# Altium project JIG_TEST_AUX_PIXYO-V10A.PrjPcb
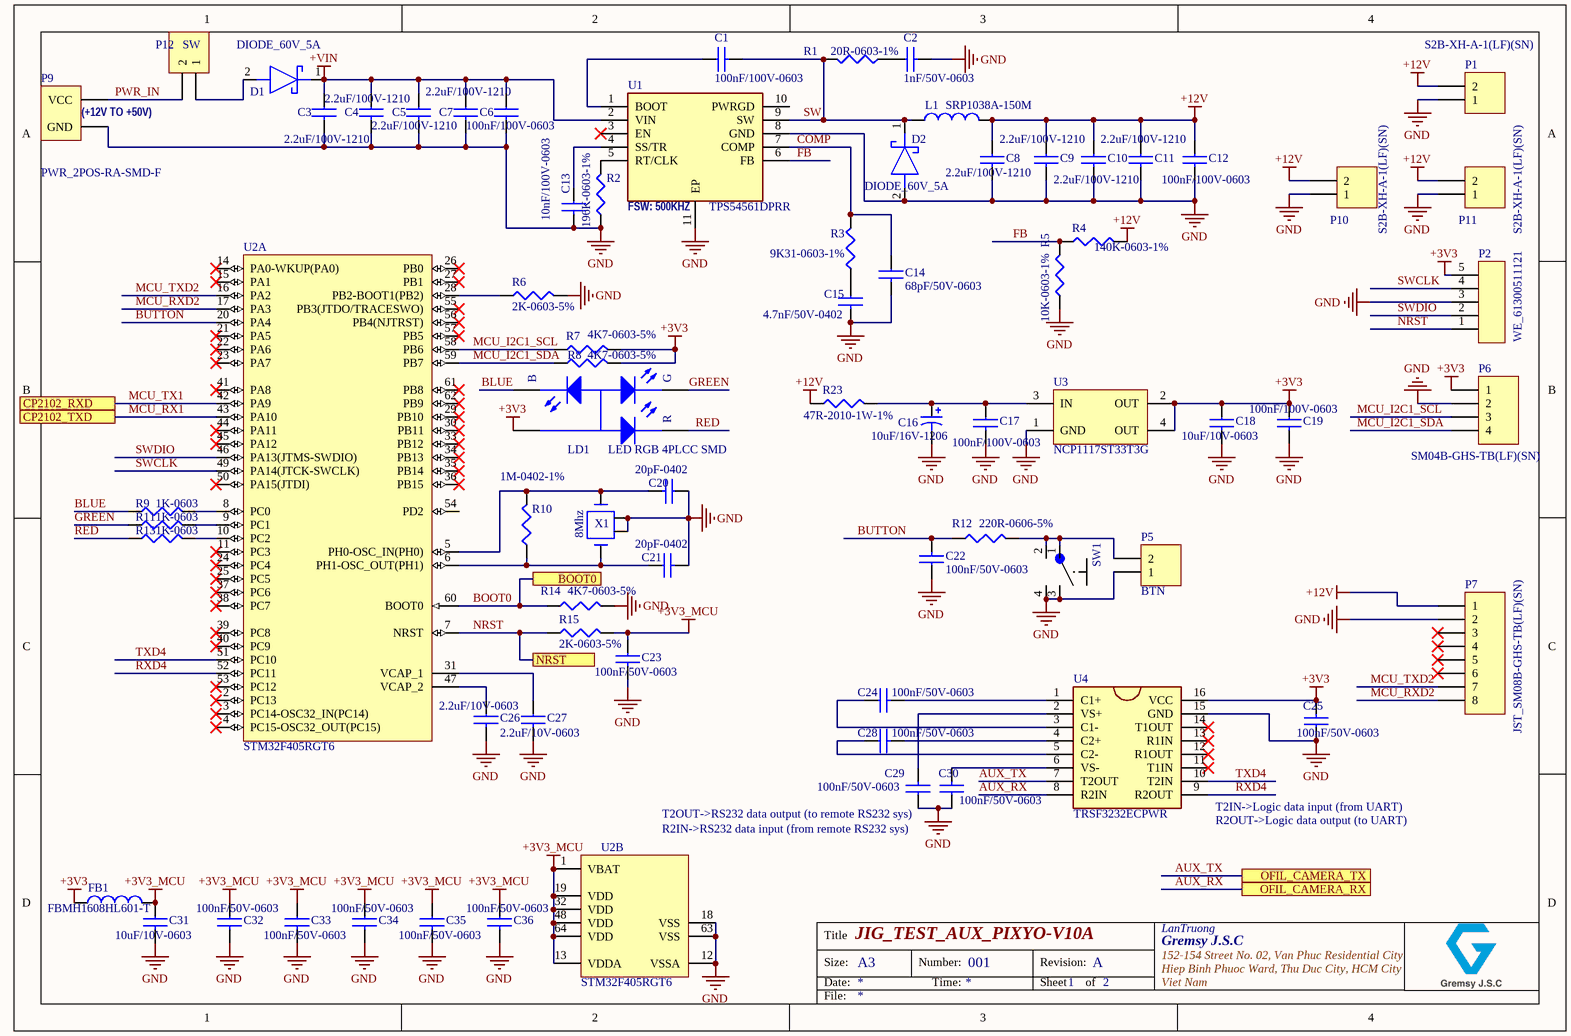
[diagram p0: JIG_TEST_AUX_PIXYO-V10A.SchDoc]
2 sheets, 95 parts. Net scope: flat (ports and power ports of the same name join across sheets).
Board files: JIG_TEST_AUX_PIXYO-V10A.PcbDoc, 3D fan.PcbDoc
Sheets:
  JIG_TEST_AUX_PIXYO-V10A.SchDoc
  CP2102_UART.SchDoc

## Sheet JIG_TEST_AUX_PIXYO-V10A.SchDoc: JIG_TEST_AUX_PIXYO-V10A
size A4; Author: LanTruong; CompanyName: Gremsy J.S.C; Organization: Altium Limited; Address1: 152-154 Street No. 02, Van Phuc Residential City; Address2: Hiep Binh Phuoc Ward, Thu Duc City, HCM City; Address3: Viet Nam; DocumentNumber: 001; Revision: A; SheetNumber: 1; SheetTotal: 2

### Parts
C1  100nF/100V-0603  [CAP0603]
C2  1nF/50V-0603  [CAP0603]
C3  2.2uF/100V-1210  [CAP1210]
C4  2.2uF/100V-1210  [CAP1210]
C5  2.2uF/100V-1210  [CAP1210]
C6  100nF/100V-0603  [CAP0603]
C7  2.2uF/100V-1210  [CAP1210]
C8  2.2uF/100V-1210  [CAP1210]
C9  2.2uF/100V-1210  [CAP1210]
C10  2.2uF/100V-1210  [CAP1210]
C11  2.2uF/100V-1210  [CAP1210]
C12  100nF/100V-0603  [CAP0603]
C13  10nF/100V-0603  [CAP0603]
C14  68pF/50V-0603  [CAP0603]
C15  4.7nF/50V-0402  [CAP0402]
C16  10uF/16V-1206  [CAP1206_TANTALUM_YELLOW]
C17  100nF/100V-0603  [CAP0603]
C18  10uF/10V-0603  [CAP0603]
C19  100nF/100V-0603  [CAP0603]
C20  20pF-0402  [CAP0402]
C21  20pF-0402  [CAP0402]
C22  100nF/50V-0603  [CAP0603]
C23  100nF/50V-0603  [CAP0603]
C24  100nF/50V-0603  [CAP0603]
C25  100nF/50V-0603  [CAP0603]
C26  2.2uF/10V-0603  [CAP0603]
C27  2.2uF/10V-0603  [CAP0603]
C28  100nF/50V-0603  [CAP0603]
C29  100nF/50V-0603  [CAP0603]
C30  100nF/50V-0603  [CAP0603]
C31  10uF/10V-0603  [CAP0603]
C32  100nF/50V-0603  [CAP0603]
C33  100nF/50V-0603  [CAP0603]
C34  100nF/50V-0603  [CAP0603]
C35  100nF/50V-0603  [CAP0603]
C36  100nF/50V-0603  [CAP0603]
D1  DIODE_60V_5A  [SODFL4725X105N]
D2  DIODE_60V_5A  [SODFL4725X105N]
FB1  FBMH1608HL601-T  [INDC0603]
L1  SRP1038A-150M  [INDC_SRP1038A-150M]
LD1  LED RGB 4PLCC SMD  [LED RGB 4PLCC SMD]
P1  S2B-XH-A-1(LF)(SN)  [XH2.54 2P 2pin XH-2AW Right Angle]
P2  WE_61300511121  [HDR_1x5_2m54]
P5  BTN  [JST_SM02B-GHS-TB(LF)(SN)]
P6  SM04B-GHS-TB(LF)(SN)  [JST_SM04B-GHS-TB(LF)(SN)]
P7  JST_SM08B-GHS-TB(LF)(SN)  [JST_SM08B-GHS-TB(LF)(SN)]
P9  PWR_2POS-RA-SMD-F  [DC-050]
P10  S2B-XH-A-1(LF)(SN)  [XH2.54 2P 2pin XH-2AW Right Angle]
P11  S2B-XH-A-1(LF)(SN)  [XH2.54 2P 2pin XH-2AW Right Angle]
P12  SW  [JST_B2B-XH-A(LF)(SN)]
R1  20R-0603-1%  [RES0603]
R2  196K-0603-1%  [RES0603]
R3  9K31-0603-1%  [RES0603]
R4  140K-0603-1%  [RES0603]
R5  10K-0603-1%  [RES0603]
R6  2K-0603-5%  [RES0603]
R7  4K7-0603-5%  [RES0603]
R8  4K7-0603-5%  [RES0603]
R9  1K-0603  [RES0603]
R10  1M-0402-1%  [RES0402]
R11  1K-0603  [RES0603]
R12  220R-0606-5%  [RES0603]
R13  1K-0603  [RES0603]
R14  4K7-0603-5%  [RES0603]
R15  2K-0603-5%  [RES0603]
R23  47R-2010-1W-1%  [RES2010]
SW1  SW_FSM14JLH  [Pushbutton 6x6mm]  (value not drawn)
U1  TPS54561DPRR  [SON80P400X400X80-11N-D]
U2  STM32F405RGT6  [LQFP64_L]  (parts A,B of 2)
U3  NCP1117ST33T3G  [SOT223-4M]
U4  TRSF3232ECPWR  [TSSOP-16]
X1  8Mhz  [XTAL_SMD5032]

### Ports
BOOT0, CP2102_RXD, CP2102_TXD, NRST, OFIL_CAMERA_RX, OFIL_CAMERA_TX

### Nets
+3V3: C18.1 C19.1 C25.2 FB1.1 LD1.2(A) P2.5 P6.1 R7.2 R8.2 U3.2(OUT) U3.4(OUT) U4.16(VCC)
+3V3_MCU: C23.1 C31.1 C32.1 C33.1 C34.1 C35.1 C36.1 FB1.2 R15.2 U2.1(VBAT) U2.13(VDDA) U2.19(VDD) U2.32(VDD) U2.48(VDD) U2.64(VDD)
+12V: C8.1 C9.1 C10.1 C11.1 C12.1 L1.2 P1.2 P7.1 P10.2 P11.2 R4.2 R23.1
+VIN: C3.1 C4.1 C5.1 C6.1 C7.1 D1.1(K) U1.2(VIN)
GND: C2.2 C3.2 C4.2 C5.2 C6.2 C7.2 C8.2 C9.2 C10.2 C11.2 C12.2 C13.2 C14.2 C15.2 C16.2 C17.2 C18.2 C19.2 C20.1 C21.2 C22.1 C23.2 C25.1 C26.2 C27.2 C29.1 C30.1 C31.2 C32.2 C33.2 C34.2 C35.2 C36.2 D2.2(A) P1.1 P2.3 P5.1 P6.2 P7.2 P9.2(GND) P10.1 P11.1 R2.1 R5.1 R6.2 R14.2 SW1.3 SW1.4 U1.8(GND) U1.11(EP) U2.12(VSSA) U2.18(VSS) U2.63(VSS) U3.1(GND) U4.15(GND) X1.2(GND) X1.4(GND)
AUX_RX: U4.8(R2IN) ; port OFIL_CAMERA_RX
AUX_TX: U4.7(T2OUT) ; port OFIL_CAMERA_TX
BLUE: LD1.3(B) R9.1
BOOT0: R14.1 U2.60(BOOT0) ; port BOOT0
BUTTON: C22.2 R12.1 U2.20(PA4)
COMP: C14.1 R3.2 U1.7(COMP)
FB: R4.1 R5.2 U1.6(FB)
GREEN: LD1.4(G) R11.1
MCU_I2C1_SCL: P6.3 R7.1 U2.58(PB6)
MCU_I2C1_SDA: P6.4 R8.1 U2.59(PB7)
MCU_RX1: U2.43(PA10) ; port CP2102_TXD  [project net CP2102_TXD]
MCU_RXD2: P7.8 U2.17(PA3)
MCU_TX1: U2.42(PA9) ; port CP2102_RXD  [project net CP2102_RXD]
MCU_TXD2: P7.7 U2.16(PA2)
NRST: P2.1 R15.1 U2.7(NRST) ; port NRST
PWR_IN: P9.1(VCC) P12.2
RED: LD1.1(R) R13.1
RXD4: U2.52(PC11) U4.9(R2OUT)
SW: C1.2 D2.1(K) L1.1 R1.2 U1.9(SW)
SWCLK: P2.4 U2.49(PA14(JTCK-SWCLK))
SWDIO: P2.2 U2.46(PA13(JTMS-SWDIO))
TXD4: U2.51(PC10) U4.10(T2IN)
NetC1_1: C1.1 U1.1(BOOT)
NetC2_1: C2.1 R1.1
NetC13_1: C13.1 U1.4(SS/TR)
NetC15_1: C15.1 R3.1
NetC16_1: C16.1 C17.1 R23.2 U3.3(IN)
NetC20_2: C20.2 R10.2 U2.5(PH0-OSC_IN(PH0)) X1.3(OSC2)
NetC21_1: C21.1 R10.1 U2.6(PH1-OSC_OUT(PH1)) X1.1(OSC1)
NetC24_1: C24.1 U4.3(C1-)
NetC24_2: C24.2 U4.1(C1+)
NetC26_1: C26.1 U2.47(VCAP_2)
NetC27_1: C27.1 U2.31(VCAP_1)
NetC28_1: C28.1 U4.5(C2-)
NetC28_2: C28.2 U4.4(C2+)
NetC29_2: C29.2 U4.2(VS+)
NetC30_2: C30.2 U4.6(VS-)
NetD1_2: D1.2(A) P12.1
NetP5_2: P5.2 R12.2 SW1.1 SW1.2
NetR2_2: R2.2 U1.5(RT/CLK)
NetR6_1: R6.1 U2.28(PB2-BOOT1(PB2))
NetR9_2: R9.2 U2.8(PC0)
NetR11_2: R11.2 U2.9(PC1)
NetR13_2: R13.2 U2.10(PC2)

Not connected (* = marked no-connect by the designer): P7 3* 4* 5* 6*; U1 3(EN)* 10(PWRGD); U2 2(PC13)* 3(PC14-OSC32_IN(PC14))* 4(PC15-OSC32_OUT(PC15))* 11(PC3)* 14(PA0-WKUP(PA0))* 15(PA1)* 21(PA5)* 22(PA6)* 23(PA7)* 24(PC4)* 25(PC5)* 26(PB0)* 27(PB1)* 29(PB10)* 30(PB11)* 33(PB12)* 34(PB13)* 35(PB14)* 36(PB15)* 37(PC6)* 38(PC7)* 39(PC8)* 40(PC9)* 41(PA8)* 44(PA11)* 45(PA12)* 50(PA15(JTDI))* 53(PC12)* 54(PD2) 55(PB3(JTDO/TRACESWO))* 56(PB4(NJTRST))* 57(PB5)* 61(PB8)* 62(PB9)*; U4 11(T1IN)* 12(R1OUT)* 13(R1IN)* 14(T1OUT)*

### Notes on the sheet
- (near P9) (+12V TO +50V)
- (near U1) FSW: 500KHZ
- T2OUT->RS232 data output (to remote RS232 sys)
- R2IN->RS232 data input (from remote RS232 sys)
- (near U4) T2IN->Logic data input (from UART)
- (near U4) R2OUT->Logic data output (to UART)
- Title
- Size:
- Date:
- A3
- Number:
- Time:
- Revision:
- Sheet
- of
- File:

### Library data of the parts
C1 C6 C12 C17 C19 = CAP_100nF/100V-0603-10%: CAP CER 0.1UF 100V X7R 0603; Manufacturer: Yageo; MfrP/N: CC0603KRX7R0BB104; Tolerance: ±10%; Value: 100nF; GremsyP/N: 102-100n-007-0; Supplier 1: Digi-Key; Package / Case: 0603 (1608 Metric); ComponentLink1URL: http://media.digikey.com/pdf/Data%20Sheets/Yageo%20PDFs/NPO,%20X7R%20Mid-voltage.pdf; ComponentLink1Description: http://media.digikey.com/pdf/Data%20Sheets/Yageo%20PDFs/NPO,%20X7R%20Mid-voltage.pdf; Supplier Part Number 1: 311-1523-1-ND; Voltage - Rated: 100V
C2 = CAP_1nF/50V-0603-10%: CAP CER 1000PF 50V X7R 0603; Manufacturer: Yageo; MfrP/N: CC0603KRX7R9BB102; Tolerance: 10%; GremsyP/N: 102-1n-0030; Supplier 1: Digi-Key; Case/Package: 0603; Supplier Part Number 1: 311-1080-1-ND; Voltage: 50V
C3-C5 C7-C11 = CAP_2.2uF/100V-1210-10%: CAP CER 2.2UF 100V X7R 1210; Manufacturer: Taiyo Yuden; MfrP/N: HMK325B7225KN-T; Tolerance: ±10%; GremsyP/N: 102-2u2-0070; Supplier 1: Digi-Key; ComponentLink1URL: http://www.yuden.co.jp/productdata/catalog/en/mlcc06_e.pdf; ComponentLink1Description: http://www.yuden.co.jp/productdata/catalog/en/mlcc06_e.pdf; Supplier Part Number 1: 587-1778-1-ND; Value: 2.2uF; Voltage - Rated: 100V
C13 = CAP_10nF/100V-0603-10%: CAP CER 10000PF 100V X7R 0603; Manufacturer: Yageo; MfrP/N: CC0603KRX7R0BB103; GremsyP/N: 102-10n-0040; Tolerance: ±10%; Supplier 1: Mouser; Case/Package: 0603; Supplier Part Number 1: 603-CC603KRX7R0BB103
C14 = CAP_68pF/50V-0603-5%: CAP CER 68PF 50V C0G/NPO 0603; Manufacturer: Yageo; MfrP/N: CC0603JRNPO9BN680; Tolerance: ±5%; GremsyP/N: 102-68p-002-0; Supplier 1: Digi-Key; Voltage - Rated: 50V; Package / Case: 0603 (1608 Metric); ComponentLink1URL: http://www.yageo.com/documents/recent/UPY-GP_NP0_16V-to-50V_16.pdf; ComponentLink1Description: http://www.yageo.com/documents/recent/UPY-GP_NP0_16V-to-50V_16.pdf; Supplier Part Number 1: 311-1067-1-ND; Value: 68pF
C15 = CAP_4.7nF/50V-0402-5%: CAP CER 4700PF 50V X7R 0402; Manufacturer 1: KEMET; MfrP/N: C0402C472J5RACAUTO; Tolerance: 5%; Capacitance: 4.7nF; GremsyP/N: 102-4n7-001-0; Supplier 1: Digi-Key; Supplier Part Number 1: 399-C0402C472J5RACAUTOCT-ND; Case/Package: 0402; Voltage Rating (DC): 50V
C16 = CAP_10uF/16V-1206-10%: CAP TANT 10UF 16V 10% 1206; Manufacturer 1: KEMET; MfrP/N: T491A106K016AT; GremsyP/N: 102-10u-0070; Supplier 1: Digi-Key; Supplier Part Number 1: 399-8269-1-ND; Package / Case: 1206 (3216 Metric); ComponentLink1URL: http://www.kemet.com/Lists/ProductCatalog/Attachments/254/KEM_T2005_T491.pdf; ComponentLink1Description: http://www.kemet.com/Lists/ProductCatalog/Attachments/254/KEM_T2005_T491.pdf; Value: 10uF; Tolerance: ±10%; Voltage - Rated: 16V
C18 C31 = CAP_10uF/10V-0603-10%: CAP CER 10UF 10V X5R 0603; Manufacturer 1: Yageo; MfrP/N: CC0603KRX5R6BB106; Tolerance: ±10%; GremsyP/N: 102-10u-0050; Supplier 1: Digi-Key; Supplier Part Number 1: 311-1782-1-ND; Voltage - Rated: 10V; Package / Case: 0603 (1608 Metric); ComponentLink1URL: http://www.yageo.com/documents/recent/UPY-GPHC_X5R_4V-to-50V_24.pdf; ComponentLink1Description: http://www.yageo.com/documents/recent/UPY-GPHC_X5R_4V-to-50V_24.pdf; Value: 10uF
C20 C21 = CAP_20pF/50V-0402-1%: CAP CER 20PF 50V C0G/NP0 0402; Manufacturer 1: Murata; MfrP/N: GJM1555C1H200FB01D; Tolerance: 1%; GremsyP/N: 102-20p-001-0; Supplier 1: Digi-Key; Supplier Part Number 1: 490-11204-1-ND; Case/Package: 0402; Capacitance: 20pF; Voltage Rating: 50V
C22-C25 C28-C30 C32-C36 = CAP_100nF/50V-0603-10%: CAP CER 0.1UF 50V X7R 0603; Manufacturer 1: Yageo; MfrP/N: CC0603KRX7R9BB104; Tolerance: ±10%; Value: 100nF; GremsyP/N: 102-100n-005-0; Supplier 1: Digi-Key; Supplier Part Number 1: 311-1344-1-ND; Voltage - Rated: 50V; Package / Case: 0603 (1608 Metric); ComponentLink1URL: http://www.yageo.com/documents/recent/UPY-GPHC_X7R_6.3V-to-50V_18.pdf; ComponentLink1Description: http://www.yageo.com/documents/recent/UPY-GPHC_X7R_6.3V-to-50V_18.pdf
C26 C27 = CAP_2.2uF/10V-0603-10%: CAP CER 2.2UF 10V X7R 0603; Manufacturer 1: Yageo; MfrP/N: CC0603KRX7R6BB225; Category 1: Capacitors; Capacitance: 2.2µF; Tolerance: ±10%; GremsyP/N: 102-2u2-0010; Supplier 1: Digi-Key; Supplier Part Number 1: 311-1797-1-ND; Description 1: CAP CER 2.2UF 10V X7R 0603; Stock 1: 14291; Pricing 1: 1=0.32, 10=0.219, 100=0.1238, 500=0.0874, 1000=0.07648 (USD); Voltage - Rated: 10V; Temperature Coefficient: X7R; Operating Temperature: -55°C ~ 125°C; Package / Case: 0603 (1608 Metric); ComponentLink1URL: http://www.yageo.com/documents/recent/UPY-GPHC_X7R_6.3V-to-50V_18.pdf; ComponentLink1Description: http://www.yageo.com/documents/recent/UPY-GPHC_X7R_6.3V-to-50V_18.pdf; Value: 2.2uF
D1 D2 = DIODE-SCHOTTKY_RB088LAM-60TFTR: Schottky Diode; Manufacturer_Name: ROHM Semiconductor; GremsyP/N: 104-SCKY-011-0; Datasheet Link: https://www.mouser.com/datasheet/2/348/rb088lam-60tftr-e-1507871.pdf; Height: 1.05mm; MfrP/N: RB088LAM-60TFTR; Mouser Part Number: 755-RB088LAM-60TFTR; Mouser Price/Stock: https://www.mouser.com/Search/Refine.aspx?Keyword=755-RB088LAM-60TFTR; ComponentLink1Description: DIODE; ComponentLink1URL: https://www.mouser.vn/ProductDetail/ROHM-Semiconductor/RB088LAM-60TFTR?qs=sGAEpiMZZMutXGli8Ay4kPB6XEQFysSpXpnTjPttNqQ%3D; Manufacturer Part Number: RB088LAM-60TFTR
FB1 = FB-0603_FBMH1608HL601-T: FERRITE BEAD 600 OHM 0603 1LN; Manufacturer: Taiyo Yuden; Filter Type: Power Line; Number of Lines: 1; Impedance @ Frequency: 600 Ohm @ 100MHz; Current Rating (Max): 500mA; DC Resistance (DCR) (Max): 450 mOhm; GremsyP/N: 10E-FB0603-002-0; Supplier 1: Digi-Key; MfrP/N: FBMH1608HL601-T; RoHS: RoHS Compliant; Category: Filters; Stock 1: 9499; Pricing 1: 1=0.11, 10=0.094, 25=0.0732, 50=0.0606, 100=0.0523, 250=0.0418, 500=0.03762, 1000=0.03135 (USD); Packaging: Cut Tape (CT); Part Status: Active; Ratings: -; Operating Temperature: -40°C ~ 125°C; Package / Case: 0603 (1608 Metric); Mounting Type: Surface Mount; Height (Max): 0.035" (0.90mm); Size / Dimension: 0.063" L x 0.031" W (1.60mm x 0.80mm); ComponentLink1URL: http://ds.yuden.co.jp/TYCOMPAS/ut/detail.do?productNo=FBMH1608HL601-T&fileName=FBMH1608HL601-T_SS&mode=specSheetDownload; ComponentLink1Description: http://ds.yuden.co.jp/TYCOMPAS/ut/detail.do?productNo=FBMH1608HL601-T&fileName=FBMH1608HL601-T_SS&mode=specSheetDownload; Supplier Part Number 1: 587-1737-1-ND
L1 = IND_SRP1038A-150M: BOURNS   SRP1038A-150M   INDUCTOR, SHIELDED, 15UH, 20%, 6.25A; Core Material: Carbonyl Powder; Saturation Current: 10A; DC Resistance (DCR): 45mR; Self Resonant Frequency: 9MHz; Test Frequency: 100kHz; Supplier 1: Digi-Key; Manufacturer: Bourns; Manufacturer Part Number: SRP1038A-150M; Stock 1: 6638; Pricing 1: 1=1.51, 10=1.397, 100=0.9781 (USD); Mount: Surface Mount; Case/Package: Nonstandard; Min Operating Temperature: -40°C; Max Operating Temperature: 125°C; Inductance Tolerance: 20%; Packaging: Cut Tape; Tolerance: 20%; Composition: Wirewound; Inductance: 15uh; Current Rating: 6.25A; Shielding: Shielded; Max DC Current: 6.25A; Termination: SMD/SMT; RMS Current (Irms): 6.25A; Length: 0.433inch; Height: 3.8mm; Width: 0.394inch; Height - Seated (Max): 0.157inch; Depth: 10mm; REACH SVHC: No SVHC; ComponentLink1URL: https://datasheet.ciiva.com/46395/1828822-46395253.pdf; ComponentLink1Description: https://datasheet.ciiva.com/46395/1828822-46395253.pdf; ComponentLink2URL: https://datasheet.ciiva.com/48685/srp1038a-48685046.pdf; ComponentLink2Description: https://datasheet.ciiva.com/48685/srp1038a-48685046.pdf; Supplier Part Number 1: SRP1038A-150MDKR-ND
LD1 = LED-RGB_4PLCC_SMD: MfrP/N: VLMRGB343-ST-UV-RS; Supplier 1: Digi-Key; Supplier Part Number 1: 516-3280-1-ND; GremsyP/N: *
P1 P10 P11 = CON-JST_S2B-XH-A-1(LF)(SN): WTB-XH_2POS-P2.54-RA-TH; Manufacturer 1: JST; Description 1: 2 Position Through-Hole Shrouded Header; Category 1: Connectors; GremsyP/N: 106-JST-001; ComponentLink1Description: XH2.54 2P; ComponentLink1URL: https://www.thegioiic.com/products/cong-xh2-54-2-chan-cong; Supplier 1: Digi-Key; Supplier Part Number 1: 455-4226-ND; MfrP/N: S2B-XH-A-1(LF)(SN); RoHS 1: No; Stock 1: 2579; Pricing 1: 1=0.18000, 10=0.15200, 100=0.11650, 500=0.09862, 1000=0.08068, 5000=0.07172, 10000=0.06500 (USD); Lead Free: Lead Free
P2 = CON-WE_61300511121_DUPLICATE: HEADER HDR 1X5-P2.54-ST-TH-MALE; GremsyP/N: 106-WE-002; ComponentLink1Description: CONN HEADER VERT 5POS 2.54MM; ComponentLink1URL: https://www.digikey.com/product-detail/en/w-rth-elektronik/61300511121/732-5318-ND/4846831; MfrP/N: 61300511121
P5 = CON-JST_SM02B-GHS-TB(LF)(SN): WTB-GH_2POS-P1.25-RA-SMD; Manufacturer: JST Sales America Inc.; Connector Type: Header; Pitch - Mating: 0.049" (1.25mm); Number of Positions: 2; Number of Positions Loaded: All; Style: Board to Cable/Wire; Shrouding: Shrouded - 4 Wall; Material Flammability Rating: UL94 V-0; Current Rating: 1A; Voltage Rating: 50V; Mated Stacking Heights: 4.35mm; GremsyP/N: 106-JST-038; Supplier 1: Digi-Key; MfrP/N: SM02B-GHS-TB(LF)(SN); RoHS: RoHS Compliant; Category: Connectors, Interconnects; Stock 1: 53796; Pricing 1: 1=0.46, 10=0.438, 100=0.3067, 500=0.26292, 1000=0.2191 (USD); Packaging: Cut Tape (CT); Part Status: Active; Contact Type: Outer Shroud Contact; Number of Rows: 1; Row Spacing - Mating: -; Mounting Type: Surface Mount, Right Angle; Termination: Solder; Fastening Type: Locking Ramp; Contact Length - Mating: -; Contact Length - Post: -; Overall Contact Length: -; Insulation Height: 0.167" (4.25mm); Contact Shape: Rectangular; Contact Finish - Mating: Tin; Contact Finish Thickness - Mating: -; Contact Finish - Post: Tin; Contact Material: Phosphor Bronze; Insulation Material: Polyamide (PA9T), Nylon 9T; Features: Solder Retention; Operating Temperature: -25°C ~ 85°C; Ingress Protection: -; Insulation Color: Natural; Contact Finish Thickness - Post: -; Applications: -; ComponentLink1URL: http://www.jst-mfg.com/product/pdf/eng/eGH.pdf; ComponentLink1Description: http://www.jst-mfg.com/product/pdf/eng/eGH.pdf; Supplier Part Number 1: 455-1564-1-ND
P6 = CON-JST_SM04B-GHS-TB(LF)(SN): WTB-GH_4POS-P1.25-RA-SMD; Manufacturer: JST Sales America Inc.; Connector Type: Header; Pitch - Mating: 0.049" (1.25mm); Style: Board to Cable/Wire; Shrouding: Shrouded - 4 Wall; Number of Positions: 4; Number of Positions Loaded: All; Material Flammability Rating: UL94 V-0; Current Rating: 1A; Voltage Rating: 50V; Mated Stacking Heights: 4.35mm; GremsyP/N: 106-JST-044; Supplier 1: Digi-Key; MfrP/N: SM04B-GHS-TB(LF)(SN); RoHS: RoHS Compliant; Category: Connectors, Interconnects; Stock 1: 111522; Pricing 1: 1=0.45, 10=0.423, 100=0.3244, 500=0.28212, 1000=0.23274 (USD); Packaging: Cut Tape (CT); Part Status: Active; Contact Type: Outer Shroud Contact; Number of Rows: 1; Row Spacing - Mating: -; Mounting Type: Surface Mount, Right Angle; Termination: Solder; Fastening Type: Locking Ramp; Contact Length - Mating: -; Contact Length - Post: -; Overall Contact Length: -; Insulation Height: 0.167" (4.25mm); Contact Shape: Rectangular; Contact Finish - Mating: Tin; Contact Finish Thickness - Mating: -; Contact Finish - Post: Tin; Contact Material: Phosphor Bronze; Insulation Material: Polyamide (PA9T), Nylon 9T; Features: Solder Retention; Operating Temperature: -25°C ~ 85°C; Ingress Protection: -; Insulation Color: Natural; Contact Finish Thickness - Post: -; Applications: -; ComponentLink1URL: http://www.jst-mfg.com/product/pdf/eng/eGH.pdf; ComponentLink1Description: http://www.jst-mfg.com/product/pdf/eng/eGH.pdf; Supplier Part Number 1: 455-1566-1-ND
P7 = CON-JST_SM08B-GHS-TB(LF)(SN): WTB-GH_8POS-P1.25-RA-SMD; Manufacturer: JST Sales America Inc.; Connector Type: Header; Pitch - Mating: 0.049" (1.25mm); Style: Board to Cable/Wire; Shrouding: Shrouded - 4 Wall; Number of Positions: 8; Number of Positions Loaded: All; Material Flammability Rating: UL94 V-0; Current Rating: 1A; Voltage Rating: 50V; Mated Stacking Heights: 4.35mm; GremsyP/N: 106-JST-052; Supplier 1: Digi-Key; MfrP/N: SM08B-GHS-TB(LF)(SN); RoHS: RoHS Compliant; Category: Connectors, Interconnects; Stock 1: 28508; Pricing 1: 1=0.65, 10=0.607, 100=0.4651, 500=0.40446, 1000=0.33368 (USD); Packaging: Cut Tape (CT); Part Status: Active; Contact Type: Outer Shroud Contact; Number of Rows: 1; Row Spacing - Mating: -; Mounting Type: Surface Mount, Right Angle; Termination: Solder; Fastening Type: Locking Ramp; Contact Length - Mating: -; Contact Length - Post: -; Overall Contact Length: -; Insulation Height: 0.167" (4.25mm); Contact Shape: Rectangular; Contact Finish - Mating: Tin; Contact Finish Thickness - Mating: -; Contact Finish - Post: Tin; Contact Material: Phosphor Bronze; Insulation Material: Polyamide (PA9T), Nylon 9T; Features: Solder Retention; Operating Temperature: -25°C ~ 85°C; Ingress Protection: -; Insulation Color: Natural; Contact Finish Thickness - Post: -; Applications: -; ComponentLink1URL: http://www.jst-mfg.com/product/pdf/eng/eGH.pdf; ComponentLink1Description: http://www.jst-mfg.com/product/pdf/eng/eGH.pdf; Supplier Part Number 1: 455-1570-1-ND
P9 = CON-NONAME_2POS-RA-SMD-F: PWR DC CONNECTOR, NONAME, FEMALE, 5.5MM; GremsyP/N: 106-NONAME-006; MfrP/N: DC-050
P12 = CON-JST_B2B-XH-A(LF)(SN): WTB-XH_2POS-P2.54-ST-TH; Manufacturer 1: JST Sales America Inc.; Description 1: CONN HEADER XH TOP 2POS 2.5MM; Category 1: Connectors, Interconnects; Connector Type: Header; Pitch - Mating: 0.098" (2.50mm); Style: Board to Cable/Wire; Shrouding: Shrouded - 4 Wall; Number of Positions: 2; Number of Positions Loaded: All; Contact Length - Post: 0.134" (3.40mm); Material Flammability Rating: UL94 V-0; Current Rating: 3A; Voltage Rating: 250V; Mated Stacking Heights: 9.8mm; GremsyP/N: 106-JST-002; Supplier 1: Digi-Key; Supplier Part Number 1: 455-2247-ND; MfrP/N: B2B-XH-A(LF)(SN); RoHS 1: RoHS Compliant; Stock 1: 191105; Pricing 1: 1=0.15, 10=0.141, 100=0.0868, 500=0.07182, 1000=0.06284, 5000=0.05387, 10000=0.05237 (USD); Packaging: Bulk; Part Status: Active; Contact Type: Male Pin; Number of Rows: 1; Row Spacing - Mating: -; Mounting Type: Through Hole; Termination: Press-Fit, Solder; Fastening Type: Detent Lock; Contact Length - Mating: -; Overall Contact Length: -; Insulation Height: 0.276" (7.00mm); Contact Shape: Square; Contact Finish - Mating: Tin; Contact Finish Thickness - Mating: -; Contact Finish - Post: Tin; Contact Material: Brass; Insulation Material: Polyamide (PA66), Nylon 6/6; Features: -; Operating Temperature: -25°C ~ 85°C; Ingress Protection: -; Insulation Color: Natural; Contact Finish Thickness - Post: -; Applications: -; ComponentLink1URL: http://www.jst-mfg.com/product/pdf/eng/eXH.pdf; ComponentLink1Description: http://www.jst-mfg.com/product/pdf/eng/eXH.pdf
R1 = RES_20R-0603-1%: RES 20 OHM 1% 1/10W 0603; Manufacturer: Yageo; MfrP/N: RC0603FR-0720RL; Resistance: 20R; GremsyP/N: 101-20R-002-0; Supplier 1: Digi-Key; Case/Package: 0603; Tolerance: 1%; Supplier Part Number 1: 311-20.0HRCT-ND
R2 = RES_196K-0603-1%: RES 196K OHM 1% 1/10W 0603; Manufacturer: Yageo; MfrP/N: RC0603FR-07196KL; GremsyP/N: 101-196K-002-0; Supplier 1: Digi-Key; Package / Case: 0603 (1608 Metric); Supplier Part Number 1: 311-196KHRCT-ND; Value: 196K; Tolerance: ±1%
R3 = RES_9K31-0603-1%: RES 9.31K OHM 1% 1/10W 0603; Manufacturer: Yageo; MfrP/N: RC0603FR-079K31L; Value: 9K31; GremsyP/N: 101-9K31-002-0; Supplier 1: Digi-Key; Package / Case: 0603 (1608 Metric); ComponentLink1URL: http://www.yageo.com/documents/recent/PYu-RC_Group_51_RoHS_L_7.pdf; ComponentLink1Description: http://www.yageo.com/documents/recent/PYu-RC_Group_51_RoHS_L_7.pdf; Supplier Part Number 1: 311-9.31KHRCT-ND; Tolerance: ±1%
R4 = RES_140K-0603-1%: RES SMD 140K OHM 1% 1/10W 0603; Manufacturer: Yageo; MfrP/N: RC0603FR-07140KL; GremsyP/N: 101-140K-002-0; Supplier 1: Digi-Key; Package / Case: 0603 (1608 Metric); ComponentLink1URL: http://www.yageo.com/documents/recent/PYu-RC_Group_51_RoHS_L_7.pdf; ComponentLink1Description: http://www.yageo.com/documents/recent/PYu-RC_Group_51_RoHS_L_7.pdf; Supplier Part Number 1: 311-140KHRCT-ND; Value: 140K; Tolerance: ±1%
R5 = RES_10K-0603-1%: RES 10K OHM 1% 1/10W 0603; Manufacturer: Yageo; MfrP/N: RC0603FR-0710KL; GremsyP/N: 101-10K-002-0; Supplier 1: Digi-Key; Package / Case: 0603 (1608 Metric); ComponentLink1URL: http://www.yageo.com/documents/recent/PYu-RC_Group_51_RoHS_L_7.pdf; ComponentLink1Description: http://www.yageo.com/documents/recent/PYu-RC_Group_51_RoHS_L_7.pdf; Supplier Part Number 1: 311-10.0KHRCT-ND; Value: 10K; Tolerance: ±1%
R6 R15 = RES_2K-0603-5%: RES 2K OHM 5% 1/10W 0603; Manufacturer 1: Yageo; MfrP/N: RC0603JR-072KL; GremsyP/N: 101-2K-002-0; Supplier 1: Digi-Key; Supplier Part Number 1: 311-2.0KGRCT-ND; Resistance (Ohms): 2k; Tolerance: ±5%; Package / Case: 0603 (1608 Metric); ComponentLink1URL: http://www.yageo.com/documents/recent/PYu-RC_Group_51_RoHS_L_7.pdf; ComponentLink1Description: http://www.yageo.com/documents/recent/PYu-RC_Group_51_RoHS_L_7.pdf; Value: 2K
R7 R8 R14 = RES_4K7-0603-5%: RES 4.7K OHM 5% 1/10W 0603; Manufacturer: Yageo; MfrP/N: RC0603JR-074K7L; Value: 4K7; GremsyP/N: 101-4K7-002-0; Supplier 1: Digi-Key; Tolerance: ±5%; Package / Case: 0603 (1608 Metric); ComponentLink1URL: http://www.yageo.com/documents/recent/PYu-RC_Group_51_RoHS_L_7.pdf; ComponentLink1Description: http://www.yageo.com/documents/recent/PYu-RC_Group_51_RoHS_L_7.pdf; Supplier Part Number 1: 311-4.7KGRCT-ND
R9 R11 R13 = RES_1K-0603-5%: RES 1K OHM 5% 1/10W 0603; Manufacturer 1: Yageo; MfrP/N: RC0603JR-071KL; GremsyP/N: 101-1K-003-0; Supplier 1: Digi-Key; Supplier Part Number 1: 311-1.0KGRCT-ND; Resistance (Ohms): 1k; Tolerance: ±5%; Package / Case: 0603 (1608 Metric); ComponentLink1URL: http://www.yageo.com/documents/recent/PYu-RC_Group_51_RoHS_L_7.pdf; ComponentLink1Description: http://www.yageo.com/documents/recent/PYu-RC_Group_51_RoHS_L_7.pdf; Value: 1K
R10 = RES_1M_0402_1%: RES 1M OHM 1% 1/16W 0402; Manufacturer 1: Yageo; MfrP/N: RC0402FR-071ML; Resistance: 1MR; GremsyP/N: 101-1M-003-0; Supplier 1: RSComponents; Supplier Part Number 1: 6186194; Case/Package: 0402; Tolerance: 1%
R12 = RES_220R-0606-5%: RES 220 OHM 5% 1/10W 0603; Manufacturer 1: Yageo; MfrP/N: RC0603JR-07220RL; Resistance (Ohms): 220; GremsyP/N: 101-220R-001-0; Supplier 1: Digi-Key; Supplier Part Number 1: 311-220GRCT-ND; Tolerance: ±5%; Package / Case: 0603 (1608 Metric); ComponentLink1URL: http://www.yageo.com/documents/recent/PYu-RC_Group_51_RoHS_L_7.pdf; ComponentLink1Description: http://www.yageo.com/documents/recent/PYu-RC_Group_51_RoHS_L_7.pdf
R23 = RES_47R-2010-1W-1%: RES SMD 47 OHM 1% 1W 2010; Manufacturer: Stackpole Electronics; MfrP/N: RMCP2010FT47R0; Resistance: 47R; GremsyP/N: 101-47R-002-0; Supplier 1: Digi-Key; Case/Package: 2010; Supplier Part Number 1: RMCP2010FT47R0DKR-ND; Tolerance: 1%
SW1 = SW-TACTILE_FSM14JLH-ST-TH: SWITCH TACTILE SPST-NO 0.05A 24V, STRAIGHT, SMD; MfrP/N: FSM14J; MF: TE Connectivity; GremsyP/N: 11I-TACTILE-010; Availability: Unavailable; Price: None; Package: None; SnapEDA_Link: https://www.snapeda.com/parts/FSM14J/TE%20Connectivity%20ALCOSWITCH%20Switches/view-part/?ref=snap; Value: *
U1 = IC-PMIC-TI_TPS54561DPRR: Buck Switching Regulator IC Positive Adjustable 0.8V 1 Output 5A 10-WDFN Exposed Pad; Manufacturer_Name: Texas Instruments; GremsyP/N: 10C-PMIC-050; Datasheet Link: http://www.ti.com/lit/gpn/tps54561; Height: 0.8mm; Mouser2 Part Number: 595-TPS54561DPRR; Mouser2 Price/Stock: https://www.mouser.com/Search/Refine.aspx?Keyword=595-TPS54561DPRR; MfrP/N: TPS54561DPRR; Manufacturer Part Number: TPS54561DPRR
U2 = IC-MCU_STM32F405RGT6: ARM Cortex-M4 32-bit MCU+FPU, 210 DMIPS, 1024 kB Flash, 192 kB Internal RAM, 51 I/Os, 64-pin LQFP, -40 to 85 degC, Tray; Manufacturer: STMicroelectronics; D/A Converter: 2x12-bit; FLASH Size (Prog) (kB): 1024; I/Os (High Current): 51; Internal RAM Size (kB): 192; Operating Frequency(F) (Processor speed) (MHz): 168; Supply Voltage(Vcc) max (V): 3.6; Supply Voltage(Vcc) min (V): 1.8; GremsyP/N: 10C-MCU-007; DatasheetVersion: Rev. 4; PackageVersion: Rev. 4, 06/2013; PackageReference: LQFP64; PackageDescription: 64-Pin Low Profile Quad Flat Package, 10 x 10 mm Body, 0.5 mm Pitch; Supplier 1: Digi-Key; Supplier Part Number 1: 497-11767-ND; Supplier 2: Farnell; Supplier Part Number 2: 2064363; Supplier 3: Newark; Supplier Part Number 3: 73T2329; Supplier 4: Mouser; Supplier Part Number 4: 511-STM32F405RGT6; Core: ARM Cortex-M4; Packing: Tray; Mounting Technology: Surface Mount; MfrP/N: STM32F405RGT6
U3 = IC-PMIC-ON_NCP1117ST33T3G: IC REG LINEAR 3.3V 1A SOT223, Linear Voltage Regulator IC Positive Fixed 1 Output 1A SOT-223; GremsyP/N: 10C-PMIC-015; Supplier 1: Digi-Key; Supplier Part Number 1: NCP1117ST33T3GOSCT-ND; MfrP/N: NCP1117ST33T3G
U4 = IC-INFA-TI_TRSF3232ECPWR: IC TRANSCEIVER FULL 2/2 16TSSOP; Manufacturer_Name: Texas Instruments; GremsyP/N: 10C-INFA-006; Datasheet Link: https://www.ti.com/store/ti/en/p/product/?p=TRSF3232ECPWR&keyMatch=TRSF3232ECPWR&tisearch=search-everything&usecase=OPN; Height: 2.65mm; Manufacturer_Part_Number: TRSF3232ECPWR; Supplier 1: Digi-Key; Supplier Part Number 1: 296-25089-1-ND; MfrP/N: TRSF3232ECPWR
X1 = XTAL-8MHz_7B-8.000MAAJ-T: CRYSTAL 8.0000MHZ 18PF SMD; Manufacturer 1: TXC CORPORATION; Manufacturer Part Number: 7B-8.000MAHJ-T; Category 1: Crystals, Oscillators, Resonators; Frequency Stability: ±30ppm; ESR (Equivalent Series Resistance): 100 Ohm; Operating Mode: Fundamental; GremsyP/N: 11C-8MHz-001; Supplier 1: Digi-Key; Supplier Part Number 1: 887-1452-1-ND; MfrP/N: 7B-8.000MAAJ-T; RoHS 1: RoHS Compliant; Description 1: CRYSTAL 8.0000MHZ 18PF SMD; Stock 1: 21080; Pricing 1: 1=0.86, 10=0.759, 50=0.7096, 100=0.627, 500=0.594 (USD); Packaging: Cut Tape (CT); Part Status: Active; Type: MHz Crystal; Frequency: 8MHz; Frequency Tolerance: ±30ppm; Load Capacitance: 18pF; Operating Temperature: -20°C ~ 70°C; Ratings: -; Mounting Type: Surface Mount; Package / Case: 4-SMD, No Lead; Size / Dimension: 0.197" L x 0.126" W (5.00mm x 3.20mm); Height - Seated (Max): 0.041" (1.05mm); ComponentLink1URL: http://www.txccorp.com/download/products/quartz_crystals/2015TXC_7B_19.pdf; ComponentLink1Description: http://www.txccorp.com/download/products/quartz_crystals/2015TXC_7B_19.pdf

## Sheet CP2102_UART.SchDoc: CP2102_UART
size A4; Author: LanTruong; CompanyName: Gremsy J.S.C; Organization: Altium Limited; Address1: 152-154 Street No. 02, Van Phuc Residential City,; Address2: Hiep Binh Phuoc Ward, Thu Duc City, HCM City,; Address3: Viet Nam; DocumentNumber: 002; Revision: A; SheetNumber: 2; SheetTotal: 2
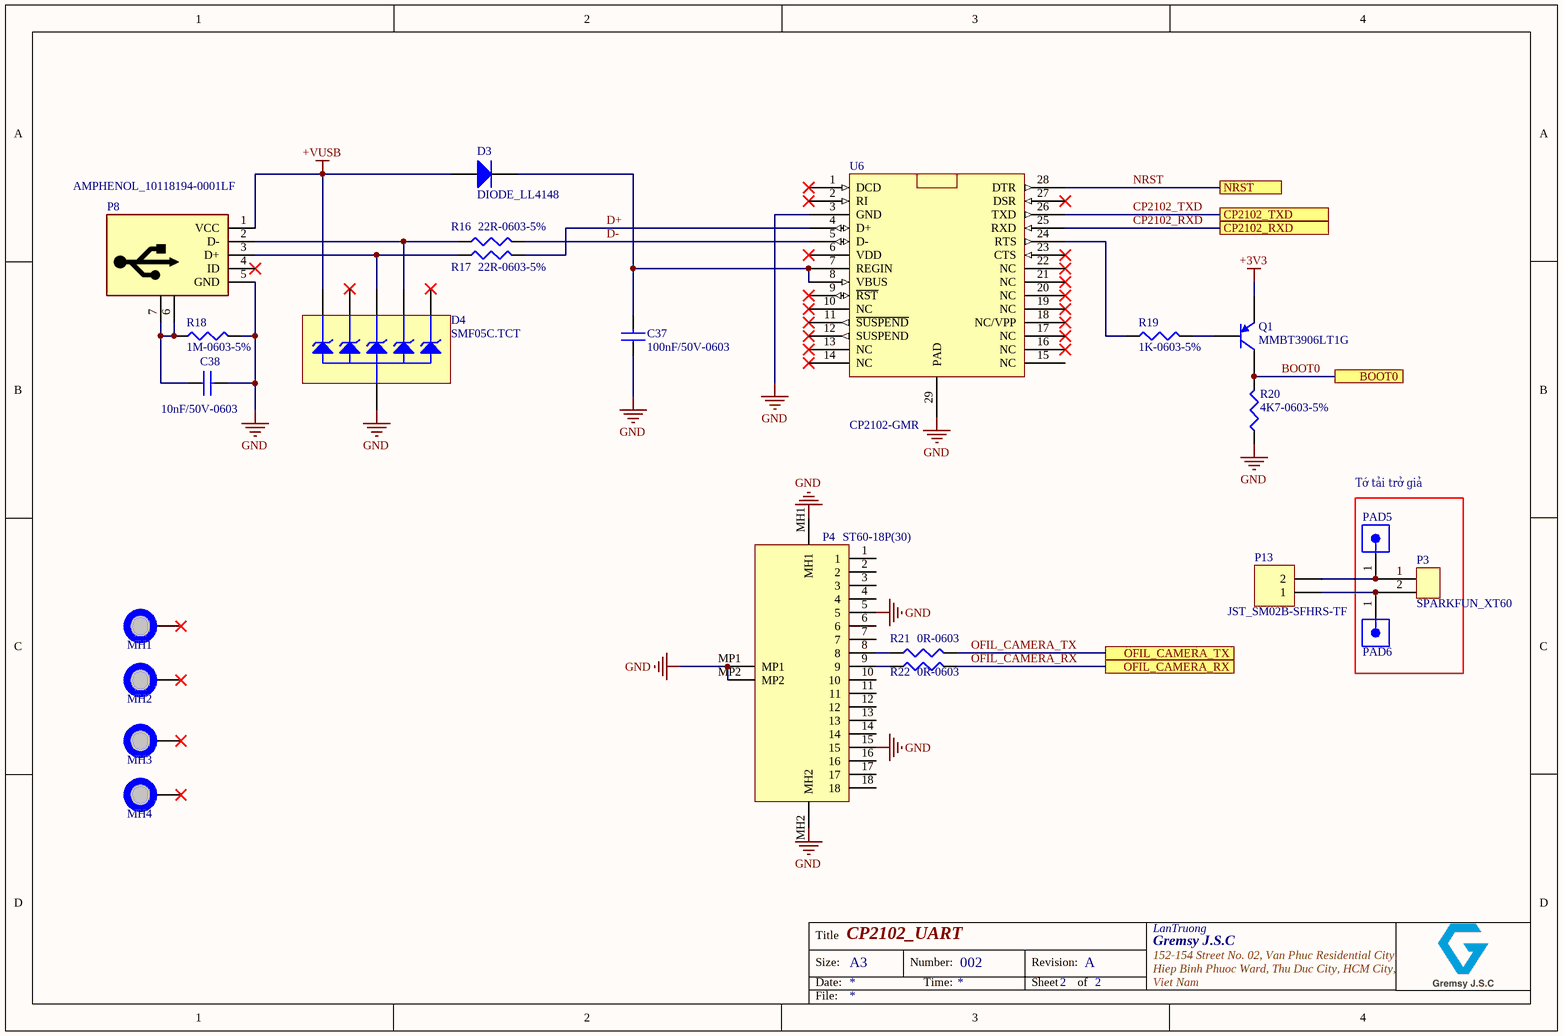
[diagram p1: CP2102_UART.SchDoc]

### Parts
C37  100nF/50V-0603  [CAP0603]
C38  10nF/50V-0603  [CAP0603]
D3  DIODE_LL4148  [SOD80]
D4  SMF05C.TCT  [SC-88]
MH1  MH_3MMC_2.1MMD  [MH_3MMD_2.1MMD]  (value not drawn)  (no BOM)
MH2  MH_3MMC_2.1MMD  [MH_3MMD_2.1MMD]  (value not drawn)  (no BOM)
MH3  MH_3MMC_2.1MMD  [MH_3MMD_2.1MMD]  (value not drawn)  (no BOM)
MH4  MH_3MMC_2.1MMD  [MH_3MMD_2.1MMD]  (value not drawn)  (no BOM)
P3  SPARKFUN_XT60  [XT60_MALE_RA]
P4  ST60-18P(30)  [ST6018P30]
P8  AMPHENOL_10118194-0001LF  [USB-B-Micro_10118194-0001LF]
P13  JST_SM02B-SFHRS-TF  [JST_M02B-SFHRS-TF(LF)(SN)]
PAD5  PAD_2.5MM_1.5MM  [PAD_2.5MM_1.5MM_HOLE]  (value not drawn)  (no BOM)
PAD6  PAD_2.5MM_1.5MM  [PAD_2.5MM_1.5MM_HOLE]  (value not drawn)  (no BOM)
Q1  MMBT3906LT1G  [SOT23]
R16  22R-0603-5%  [RES0603]
R17  22R-0603-5%  [RES0603]
R18  1M-0603-5%  [RES0603]
R19  1K-0603-5%  [RES0603]
R20  4K7-0603-5%  [RES0603]
R21  0R-0603  [RES0603]
R22  0R-0603  [RES0603]
U6  CP2102-GMR  [QFN28-Pitch 0.5 mm]

### Blocks framed on the sheet
Tớ tải trở giả: P3 PAD5 PAD6

### Ports
BOOT0, CP2102_RXD, CP2102_TXD, NRST, OFIL_CAMERA_RX, OFIL_CAMERA_TX

### Nets
+3V3: Q1.2(E)
+VUSB: D3.1(A) D4.1 P8.1(VCC)
GND: C37.1 C38.2 D4.2 P4.5 P4.15 P4.MH1 P4.MH2 P4.MP1 P4.MP2 P8.5(GND) R18.2 R20.1 U6.3(GND) U6.29(PAD)
BOOT0: Q1.3(C) R20.2 ; port BOOT0
CP2102_RXD: U6.25(RXD) ; port CP2102_RXD
CP2102_TXD: U6.26(TXD) ; port CP2102_TXD
D+: R17.2 U6.4(D+)
D-: R16.2 U6.5(D-)
NRST: U6.28(DTR) ; port NRST
OFIL_CAMERA_RX: R22.2 ; port OFIL_CAMERA_RX  [project net AUX_RX]
OFIL_CAMERA_TX: R21.2 ; port OFIL_CAMERA_TX  [project net AUX_TX]
NetC37_2: C37.2 D3.2(K) U6.7(REGIN) U6.8(VBUS)
NetC38_1: C38.1 P8.6(SHIELD) P8.7(SHIELD) R18.1
NetD4_4: D4.4 P8.3(D+) R17.1
NetD4_5: D4.5 P8.2(D-) R16.1
NetP3_1: P3.1 P13.2 PAD5.1
NetP3_2: P3.2 P13.1 PAD6.1
NetP4_8: P4.8 R21.1
NetP4_9: P4.9 R22.1
NetQ1_1: Q1.1(B) R19.2
NetR19_1: R19.1 U6.24(RTS)

Not connected (* = marked no-connect by the designer): D4 3* 6*; MH1 1*; MH2 1*; MH3 1*; MH4 1*; P4 1 2 3 4 6 7 10 11 12 13 14 16 17 18; P8 4(ID)*; U6 1(DCD)* 2(RI)* 6(VDD)* 9(~{RST})* 10(NC)* 11(~{SUSPEND})* 12(SUSPEND)* 13(NC)* 14(NC)* 15(NC) 16(NC)* 17(NC)* 18(NC/VPP)* 19(NC)* 20(NC)* 21(NC)* 22(NC)* 23(CTS)* 27(DSR)*

### Notes on the sheet
- Title
- Size:
- Date:
- A3
- Number:
- Time:
- Revision:
- Sheet
- of
- File:

### Library data of the parts
C37 = CAP_100nF/50V-0603-10%: as C22 on sheet JIG_TEST_AUX_PIXYO-V10A; Supplier 1: Digi-Key; Supplier Part Number 1: 311-1344-1-ND; Voltage - Rated: 50V; Package / Case: 0603 (1608 Metric); ComponentLink1URL: http://www.yageo.com/documents/recent/UPY-GPHC_X7R_6.3V-to-50V_18.pdf; ComponentLink1Description: http://www.yageo.com/documents/recent/UPY-GPHC_X7R_6.3V-to-50V_18.pdf
C38 = CAP_10nF/50V-0603-10%: CAP CER 10000PF 50V X7R 0603; Manufacturer 1: Yageo; MfrP/N: CC0603KRX7R9BB103; Tolerance: ±10%; Value: 10nF; GremsyP/N: 102-10n-0030; Supplier 1: Digi-Key; Supplier Part Number 1: 311-1085-1-ND; Voltage - Rated: 50V; Package / Case: 0603 (1608 Metric); ComponentLink1URL: http://www.yageo.com/documents/recent/UPY-GPHC_X7R_6.3V-to-50V_18.pdf; ComponentLink1Description: http://www.yageo.com/documents/recent/UPY-GPHC_X7R_6.3V-to-50V_18.pdf
D3 = DIODE-RECTIFIER_LL4148: DIODE GEN PURP 100V 200MA SOD80; Manufacturer: Fairchild/ON Semiconductor; MfrP/N: LL4148; Diode Type: Standard; Voltage - Forward (Vf) (Max) @ If: 1V @ 10mA; Speed: Small Signal =< 200mA (Io), Any Speed; Current - Reverse Leakage @ Vr: 25nA @ 20V; Capacitance @ Vr, F: 4pF @ 0V, 1MHz; GremsyP/N: 104-RECT-002-0; Supplier 1: Digi-Key; RoHS: RoHS Compliant; Category: Discrete Semiconductor Products; Stock 1: 494912; Pricing 1: 1=0.1, 10=0.095, 100=0.0518, 500=0.03188, 1000=0.02174 (USD); Packaging: Cut Tape (CT); Part Status: Active; Current - Average Rectified (Io): 200mA; Mounting Type: Surface Mount; Package / Case: DO-213AC, MINI-MELF, SOD-80; Supplier Device Package: SOD-80; Operating Temperature - Junction: -55°C ~ 175°C; ComponentLink1URL: https://www.fairchildsemi.com/datasheets/LL/LL4148.pdf; ComponentLink1Description: https://www.fairchildsemi.com/datasheets/LL/LL4148.pdf; Supplier Part Number 1: LL4148FSCT-ND
D4 = DIODE-ESD_SMF05C.TCT: TVS DIODE 5VWM 12.5VC SC70-6; Manufacturer 1: Semtech Corporation; Category 1: Circuit Protection; Type: Zener; Voltage - Reverse Standoff (Typ): 5V (Max); Voltage - Breakdown (Min): 6V; Voltage - Clamping (Max) @ Ipp: 12.5V; Current - Peak Pulse (10/1000µs): 8A (8/20µs); Power - Peak Pulse: 100W; Power Line Protection: No; Capacitance @ Frequency: 130pF @ 1MHz; GremsyP/N: 104-ESD-010-0; Supplier 1: Digi-Key; Supplier Part Number 1: SMF05CCT-ND; MfrP/N: SMF05C.TCT; RoHS 1: RoHS Compliant; Description 1: TVS DIODE 5VWM 12.5VC SC70-6; Stock 1: 35242; Pricing 1: 1=0.87, 10=0.757, 25=0.6704, 100=0.584, 250=0.50832, 500=0.4326, 1000=0.34608 (USD); Packaging: Cut Tape (CT); Part Status: Active; Applications: General Purpose; Operating Temperature: -55°C ~ 125°C (TJ); Mounting Type: Surface Mount; Package / Case: 6-TSSOP, SC-88, SOT-363; Supplier Device Package: SC-70-6; ComponentLink1URL: http://www.semtech.com/images/datasheet/smf05c.pdf; ComponentLink1Description: http://www.semtech.com/images/datasheet/smf05c.pdf; Manufacturer Part Number: SMF05C.TCT
MH1-MH4 = MH_3MMC_2.1MMD: Mounting Hole 3mm Diameter, 2.1mm Drill
P3 = CON-SPARKFUN_XT60: CON XT-60, MALE PIN, THROUGH HOLE, 500V, 30A; Manufacturer: SparkFun Electronics; GremsyP/N: 106-SPARKFUN-001; MfrP/N: XT-60
P4 = CON-HIROSE_ST60-18P(30): HEADER 18POS PITCH 0.5MM, SMD, ST, FEMALE; Manufacturer 1: Hirose; Description 1: Interface Connectors for Portable Terminal Devices, -30 to 80 ℃, RoHS; Category 1: Connectors; Connector Type: Receptacle,Non-Gendered; Number of Positions: 18; Gender: Receptacle; Current Rating: 500mA; Pitch: 0.02inch; Supplier 1: Digi-Key; Supplier Part Number 1: H125265CT-ND; Manufacturer Part Number 1: ST60-18P(30); RoHS 1: Yes; Stock 1: 33582; Pricing 1: 1=1.60000, 10=1.45500, 25=1.36640, 50=1.30680, 100=1.24740, 250=1.12860, 500=1.03950 (USD); Mount: Surface Mount; Number of Pins: 18; Color: Black; Contact Material: Copper Alloy; Contact Plating: Gold; Packaging: Tape and Reel; Number of Rows: 1; Termination: Solder; REACH SVHC: Unknown; Flammability Rating: UL94 V-0; Lead Free: Lead Free; RoHS Compliant: Yes; ComponentLink1URL: http://www.farnell.com/datasheets/691909.pdf?src-supplier=Element14; ComponentLink1Description: http://www.farnell.com/datasheets/691909.pdf?src-supplier=Element14; ComponentLink2URL: https://www.hirose.com/product/en/download_file/key_name/ST/category/Catalog/doc_file_id/49740/?file_category_id=4&item_id=161&is_series=1&src-supplier=Digi-Key; ComponentLink2Description: https://www.hirose.com/product/en/download_file/key_name/ST/category/Catalog/doc_file_id/49740/?file_category_id=4&item_id=161&is_series=1&src-supplier=Digi-Key
P8 = CON-AMPHENOL_10118194-0001LF: USB2.0 MICRO_5POS-RA-SMD-F-AM, FEMALE; Manufacturer 1: Amphenol FCI; Description 1: CONN USB MICRO B RECPT SMT R/A; Category 1: Connectors, Interconnects; Connector Type: USB - micro B; Number of Contacts: 5; Gender: Receptacle; GremsyP/N: 106-AMPHENOL-008; Number of Ports: 1; Current Rating: 1.8A per Contact; Voltage - Rated: 100VAC; Shielding: Shielded; Supplier 1: Digi-Key; Supplier Part Number 1: 609-4618-1-ND; MfrP/N: 10118194-0001LF; RoHS 1: RoHS Compliant; Stock 1: 208581; Pricing 1: 1=0.46, 10=0.437, 25=0.3744, 50=0.318, 100=0.3056, 250=0.27444, 500=0.26196 (USD); Packaging: Cut Tape (CT); Part Status: Active; Specifications: USB 2.0; Mounting Type: Surface Mount, Right Angle; Through Hole; Mounting Feature: Horizontal; Termination: Solder; Features: Solder Retention; Operating Temperature: -30°C ~ 80°C; Contact Finish: Gold; Shell/Shielding Material: Steel, Stainless; ComponentLink1URL: http://portal.fciconnect.com/Comergent//fci/drawing/10118194.pdf; ComponentLink1Description: http://portal.fciconnect.com/Comergent//fci/drawing/10118194.pdf
P13 = CON-JST_SM02B-SFHRS-TF: PWR_2POS-P1.8-RA-SMD-M; Manufacturer: JST; MfrP/N: SM02B-SFHRS-TF(LF)(SN); Number of Positions: 2; Gender: Male; Connector Type: Male Pin; Pitch: 0.071inch; GremsyP/N: 106-JST-039; Supplier 1: Digi-Key; Stock 1: 73385; Pricing 1: 1=0.7, 10=0.653, 100=0.5006, 500=0.4353, 1000=0.3591 (USD); Mount: Surface Mount; Colour: Red; Contact Material: Copper; Contact Plating: Tin; Number of Rows: 1; Packaging: Cut Tape; Fastening Type: Detent; Number of Contacts: 2; REACH SVHC: Unknown; Lead Free: Lead Free; Supplier Part Number 1: 455-2524-6-ND; Termination: Solder
PAD5 PAD6 = PAD_2.5MMC_1.5MMD_HOLE
Q1 = TRNS-PNP_MMBT3906LT1G: TRANS PNP 40V 0.2A SOT23; Manufacturer 1: ON Semiconductor; Manufacturer Size Code: A; Category 1: Discrete Semiconductor Products; Current - Collector (Ic) (Max): 200mA; Vce Saturation (Max) @ Ib, Ic: 400mV @ 5mA, 50mA; DC Current Gain (hFE) (Min) @ Ic, Vce: 100 @ 10mA, 1V; Power - Max: 300mW; Frequency - Transition: 250MHz; Description 2: CAP TANT 10UF 10V 10% 1206; Category 2: Capacitors; Capacitance: 10µF; Tolerance: ±10%; Voltage - Rated: 10V; Type: Molded; ESR (Equivalent Series Resistance): 2 Ohm; GremsyP/N: 109-PNP-001-0; Supplier 1: Digi-Key; Supplier Part Number 1: MMBT3906LT1GOSDKR-ND; MfrP/N: MMBT3906LT1G; RoHS 1: RoHS Compliant; Description 1: TRANS PNP 40V 0.2A SOT23; Stock 1: 104972; Pricing 1: 1=0.11, 10=0.105, 100=0.0569, 500=0.03504, 1000=0.02389 (USD); Packaging: Digi-Reel®; Part Status: Active; Transistor Type: PNP; Voltage - Collector Emitter Breakdown (Max): 40V; Current - Collector Cutoff (Max): -; Operating Temperature: -55°C ~ 150°C (TJ); Mounting Type: Surface Mount; Package / Case: TO-236-3, SC-59, SOT-23-3; Supplier Device Package: SOT-23-3 (TO-236); ComponentLink1URL: http://www.onsemi.com/pub_link/Collateral/MMBT3906LT1-D.PDF; ComponentLink1Description: http://www.onsemi.com/pub_link/Collateral/MMBT3906LT1-D.PDF; Supplier 2: Digi-Key; Supplier Part Number 2: 718-1969-1-ND; Manufacturer 2: Vishay Sprague; Manufacturer Part Number 2: 593D106X9010A2TE3; RoHS 2: RoHS Compliant; Stock 2: 5789; Pricing 2: 1=0.5, 10=0.344, 100=0.2065, 500=0.15486, 1000=0.13077 (USD); Lifetime @ Temp.: -; Size / Dimension: 0.126" L x 0.063" W (3.20mm x 1.60mm); Height - Seated (Max): 0.071" (1.80mm); Lead Spacing: -; Features: General Purpose; Failure Rate: -; ComponentLink2URL: http://www.vishay.com/docs/40005/593d.pdf; ComponentLink2Description: http://www.vishay.com/docs/40005/593d.pdf; Manufacturer Part Number: MMBT3906LT1G
R16 R17 = RES_22R-0603-5%: RES 22 OHM 5% 1/10W 0603; Manufacturer 1: Yageo; MfrP/N: RC0603JR-0722RL; Value: 22R; GremsyP/N: 101-22R-002-0; Supplier 1: Digi-Key; Supplier Part Number 1: 311-22GRCT-ND; Package / Case: 0603 (1608 Metric); Tolerance: ±5%
R18 = RES_1M-0603-5%: RES 1M OHM 5% 1/10W 0603; Manufacturer 1: Yageo; MfrP/N: RC0603JR-071ML; GremsyP/N: 101-1M-002-0; Supplier 1: Digi-Key; Supplier Part Number 1: 311-1.0MGRCT-ND; Resistance (Ohms): 1M; Tolerance: ±5%; Package / Case: 0603 (1608 Metric); ComponentLink1URL: http://www.yageo.com/documents/recent/PYu-RC_Group_51_RoHS_L_7.pdf; ComponentLink1Description: http://www.yageo.com/documents/recent/PYu-RC_Group_51_RoHS_L_7.pdf; Value: 1M
R19 = RES_1K-0603-5%: as R9 on sheet JIG_TEST_AUX_PIXYO-V10A; Supplier 1: Digi-Key; Supplier Part Number 1: 311-1.0KGRCT-ND; Resistance (Ohms): 1k; Tolerance: ±5%; Package / Case: 0603 (1608 Metric); ComponentLink1URL: http://www.yageo.com/documents/recent/PYu-RC_Group_51_RoHS_L_7.pdf; ComponentLink1Description: http://www.yageo.com/documents/recent/PYu-RC_Group_51_RoHS_L_7.pdf; Value: 1K
R20 = RES_4K7-0603-5%: as R7 on sheet JIG_TEST_AUX_PIXYO-V10A; Supplier 1: Digi-Key; Tolerance: ±5%; Package / Case: 0603 (1608 Metric); ComponentLink1URL: http://www.yageo.com/documents/recent/PYu-RC_Group_51_RoHS_L_7.pdf; ComponentLink1Description: http://www.yageo.com/documents/recent/PYu-RC_Group_51_RoHS_L_7.pdf; Supplier Part Number 1: 311-4.7KGRCT-ND
R21 R22 = RES_0R-0603: RES 0 OHM JUMPER 1/10W 0603; Manufacturer 1: Yageo; MfrP/N: RC0603JR-070RL; Value: 0R; GremsyP/N: 101-0R-002-0; Supplier 1: Digi-Key; Supplier Part Number 1: 311-0.0GRCT-ND; Tolerance: Jumper; Package / Case: 0603 (1608 Metric); ComponentLink1URL: http://www.yageo.com/documents/recent/PYu-RC_Group_51_RoHS_L_7.pdf; ComponentLink1Description: http://www.yageo.com/documents/recent/PYu-RC_Group_51_RoHS_L_7.pdf
U6 = CP2102-GMR: IC USB-TO-UART BRIDGE 28VQFN; Manufacturer 1: Silicon Labs; Category 1: Integrated Circuits (ICs); Protocol: USB; Function: Bridge, USB to UART; Interface: UART; Standards: USB 2.0; Voltage - Supply: 3 V ~ 3.6 V; Current - Supply: 20mA; Supplier 1: Digi-Key; Supplier Part Number 1: 336-1160-1-ND; Manufacturer Part Number 1: CP2102-GMR; RoHS 1: RoHS Compliant; Description 1: IC USB-TO-UART BRIDGE 28VQFN; Stock 1: 39071; Pricing 1: 1=2.88, 25=2.7736, 100=2.6668 (USD); Packaging: Cut Tape (CT); Part Status: Active; Operating Temperature: -40°C ~ 85°C; Package / Case: 28-VFQFN Exposed Pad; Supplier Device Package: 28-QFN (5x5); ComponentLink1URL: http://www.silabs.com/documents/public/data-sheets/CP2102-9.pdf; ComponentLink1Description: http://www.silabs.com/documents/public/data-sheets/CP2102-9.pdf

## Nets that join several sheets
+3V3: JIG_TEST_AUX_PIXYO-V10A (12 pins), CP2102_UART (Q1.2)
GND: JIG_TEST_AUX_PIXYO-V10A (57 pins), CP2102_UART (14 pins)
AUX_RX: JIG_TEST_AUX_PIXYO-V10A (U4.8), CP2102_UART (R22.2)
AUX_TX: JIG_TEST_AUX_PIXYO-V10A (U4.7), CP2102_UART (R21.2)
BOOT0: JIG_TEST_AUX_PIXYO-V10A (R14.1 U2.60), CP2102_UART (Q1.3 R20.2)
CP2102_RXD: JIG_TEST_AUX_PIXYO-V10A (U2.42), CP2102_UART (U6.25)
CP2102_TXD: JIG_TEST_AUX_PIXYO-V10A (U2.43), CP2102_UART (U6.26)
NRST: JIG_TEST_AUX_PIXYO-V10A (P2.1 R15.1 U2.7), CP2102_UART (U6.28)